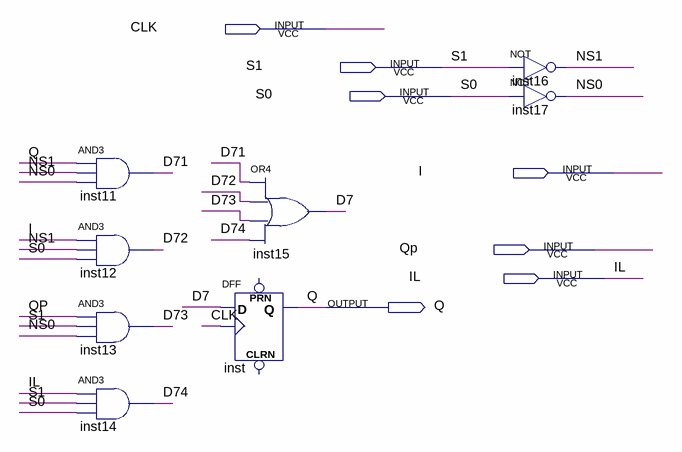
[diagram p0: schematic sheet]
// Quartus schematic 1bit_shifter.bdf as structural Verilog: 8 symbols, 7 pins
module \1bit_shifter  (
  input  CLK,
  input  S1,
  input  S0,
  input  I,
  input  Qp,
  input  IL,
  output Q
);

  wire D7, D71, D72, D73, D74, NS0, NS1;

  and inst11 (D71, Q, NS1, NS0);
  and inst12 (D72, I, NS1, S0);
  and inst13 (D73, Qp, S1, NS0);
  and inst14 (D74, IL, S1, S0);
  DFF inst (.CLK(CLK), .D(D7), .Q(Q));  // open: CLRN, PRN
  or inst15 (D7, D71, D72, D73, D74);
  not inst16 (NS1, S1);
  not inst17 (NS0, S0);
endmodule
